# EAGLE design ProjectorAdapter (EAGLE 7.3.0)
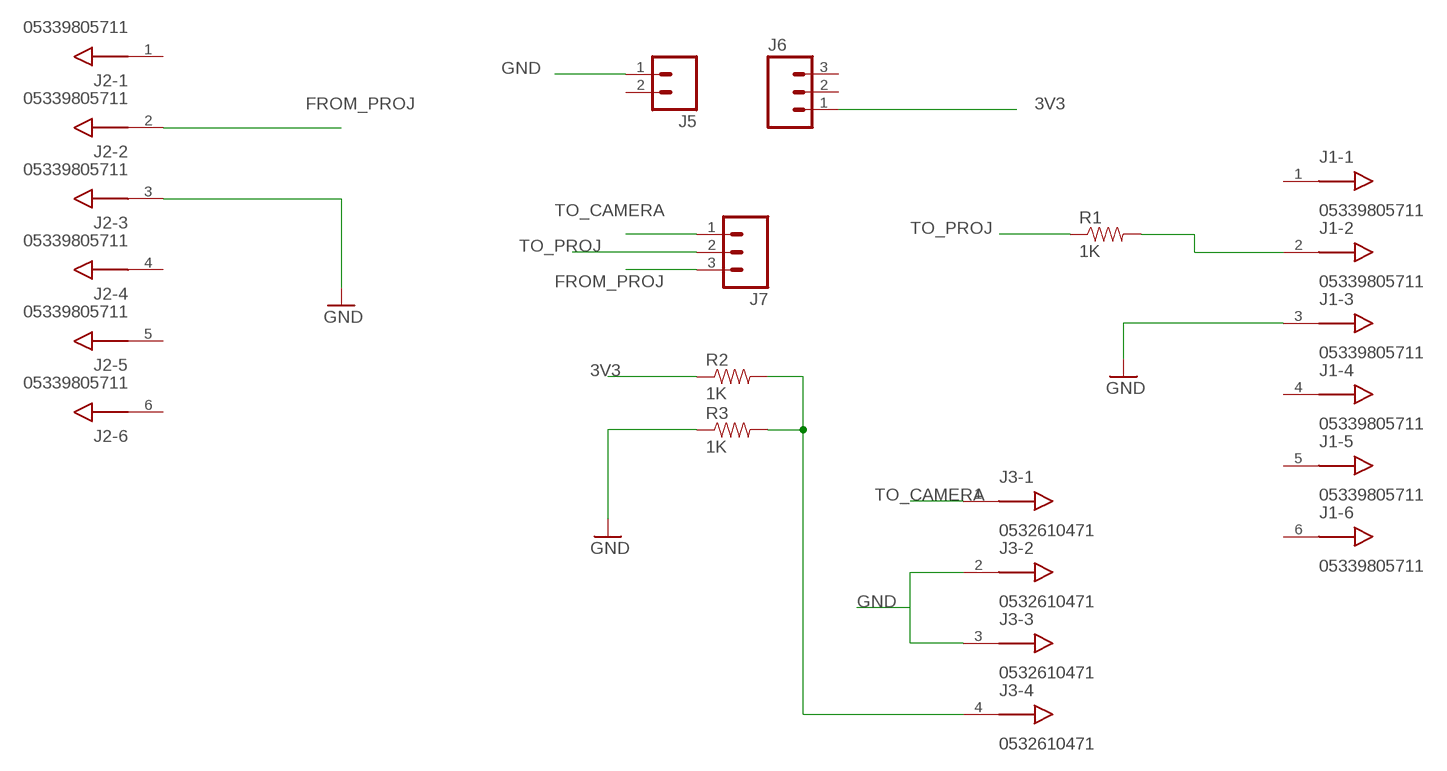
[diagram p0: schematic, sheet 1]

## Parts
J1  05339805711  [PICOBLADE53398-0671]
J2  05339805711  [PICOBLADE53398-0671]
J3  0532610471  [PICOBLADE53261-0471]
J5  M02PTH  [1X02]
J6  M03PTH  [1X03]
J7  M03PTH  [1X03]
R1  1K  RESISTOR0603-RES  [0603-RES]
R2  1K  RESISTOR0603-RES  [0603-RES]
R3  1K  RESISTOR0603-RES  [0603-RES]

## Nets
3V3: J6.1 R2.1
FROM_PROJ: J2.2 J7.3
GND: J1.3 J2.3 J3.2 J3.3 J5.1 R3.1
N$2: J3.4 R2.2 R3.2
N$4: J1.2 R1.2
TO_CAMERA: J3.1 J7.1
TO_PROJ: J7.2 R1.1
Unconnected: J1.1 J1.4 J1.5 J1.6 J2.1 J2.4 J2.5 J2.6 J5.2 J6.2 J6.3

## Library data of the parts
J1 J2 = volks73-Molex:05339805711: 1.25mm Pitch PicoBlade™ Header, Surface Mount, Vertical, 6 Circuits PicoBlade™ Connector System Documentation Drawing <http://www.molex.com/pdm_docs/sd/533980571_sd.pdf>; CATEGORY: Connectors, Interconnects; COLOR: Natural; CONNECTOR_TYPE: Header, Shrouded; CONTACT_FINISH: Tin; CONTACT_FINISH_THICKNESS: 39µin (1.00µm); CONTACT_MATING_LENGTH: -; CONTACT_TYPE: Blade Pin; DESCRIPTION: CONN HEADER 6POS 1.25MM VERT SMD; DOCUMENTATION_LINK: <a href="http://www.molex.com/pdm_docs/sd/533980571_sd.pdf">Drawing</a>; DOCUMENTATION_URL: http://www.molex.com/pdm_docs/sd/533980571_sd.pdf; FAMILY: Rectangular Connectors - Headers, Male Pins; FASTENING_TYPE: -; FEATURES: Solder Retention; MANUFACTURER: Molex Inc; MOUNTING_TYPE: Surface Mount; NUMBER_OF_POSITIONS: 5; NUMBER_OF_POSITIONS_LOADED: All; NUMBER_OF_ROWS: 1; PART_NUMBER: 05339805711; PITCH: 0.049" (1.25mm); ROW_SPACING: -; SERIES: PicoBlade™ 53398; SUPPLIER_ITEM_LINK: <a href="http://www.digikey.com/product-detail/en/0533980571/WM7609CT-ND/699083">Details</a>; SUPPLIER_ITEM_NUMBER: WM7609CT-ND; SUPPLIER_ITEM_URL: http://www.digikey.com/product-detail/en/0533980571/WM7609CT-ND/699083; SUPPLIER_LINK: <a href="http://www.digikey.com">Home Page</a>; SUPPLIER_NAME: Digi-key; SUPPLIER_URL: http://www.digikey.com; TERMINATION: Solder
J3 = volks73-Molex:0532610471: 1.25mm Pitch PicoBlade™ Header, Surface Mount, Right Angle, 4 Circuits PicoBlade™ Connector System Documentation Drawing <http://www.molex.com/pdm_docs/sd/532610471_sd.pdf>; CATEGORY: Connectors, Interconnects; COLOR: Natural; CONNECTOR_TYPE: Header, Shrouded; CONTACT_FINISH: Tin; CONTACT_FINISH_THICKNESS: 39µin (1.00µm); CONTACT_MATING_LENGTH: -; CONTACT_TYPE: Blade Pin; DESCRIPTION: CONN HEADER 4POS 1.25MM R/A SMD; DOCUMENTATION_LINK: <a href="http://www.molex.com/pdm_docs/sd/532610471_sd.pdf">Datasheet</a>; DOCUMENTATION_URL: http://www.molex.com/pdm_docs/sd/532610471_sd.pdf; FAMILY: Rectangular Connectors - Headers, Male Pins; FASTENING_TYPE: -; FEATURES: Solder Retention; MANUFACTURER: Molex Inc; MOUNTING_TYPE: Surface Mount, Right Angle; NUMBER_OF_POSITIONS: 4; NUMBER_OF_POSITIONS_LOADED: All; NUMBER_OF_ROWS: 1; PART_NUMBER: 0533980371; PITCH: 0.049" (1.25mm); ROW_SPACING: -; SERIES: PicoBlade™ 53261; SUPPLIER_ITEM_LINK: <a href="http://www.digikey.com/product-detail/en/0532610471/WM7622CT-ND/699109">Details</a>; SUPPLIER_ITEM_NUMBER: WM7622CT-ND; SUPPLIER_ITEM_URL: http://www.digikey.com/product-detail/en/0532610471/WM7622CT-ND/699109; SUPPLIER_LINK: <a href="http://www.digikey.com">Home Page</a>; SUPPLIER_NAME: Digi-Key; SUPPLIER_URL: http://www.digikey.com; TERMINATION: Solder
J5 = SparkFun-Connectors:M02: Standard 2-pin 0.1" header. Use with - straight break away headers ( PRT-00116) - right angle break away headers (PRT-00553) - swiss pins (PRT-00743) - machine pins (PRT-00117) - female headers (PRT-00115) Molex polarized connector foot print use with: PRT-08233 with associated crimp pins and housings. 2.54_SCREWTERM for use with PRT-10571. 3.5mm Screw Terminal footprints for PRT-08084 5mm Screw Terminal footprints for use with PRT-08432
J6 J7 = SparkFun-Connectors:M03: Header 3 Standard 3-pin 0.1" header. Use with straight break away headers (SKU : PRT-00116), right angle break away headers (PRT-00553), swiss pins (PRT-00743), machine pins (PRT-00117), and female headers (PRT-00115). Molex polarized connector foot print use with SKU : PRT-08232 with associated crimp pins and housings.
R1-R3 = SparkFun-Passives:RESISTOR: Resistor Basic schematic elements and footprints for 0603, 1206, and PTH resistors.

## Board
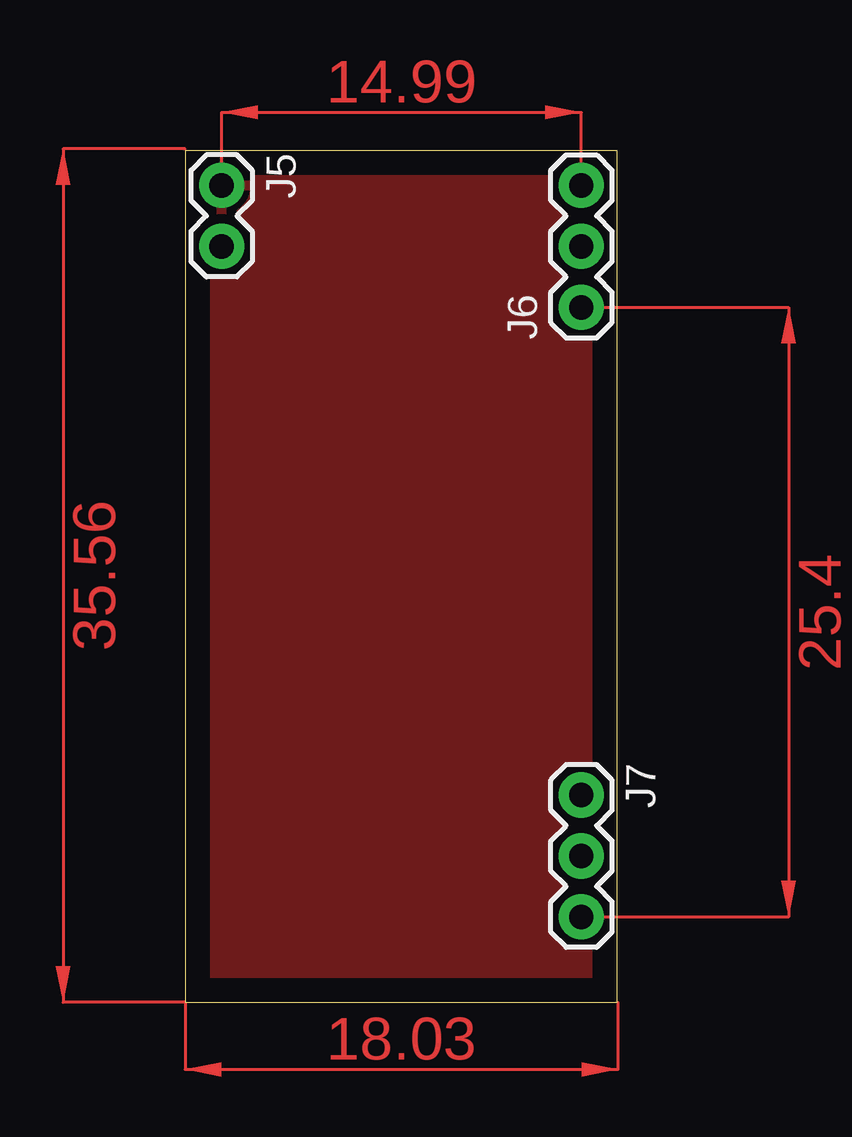
[diagram p1: board, top side]
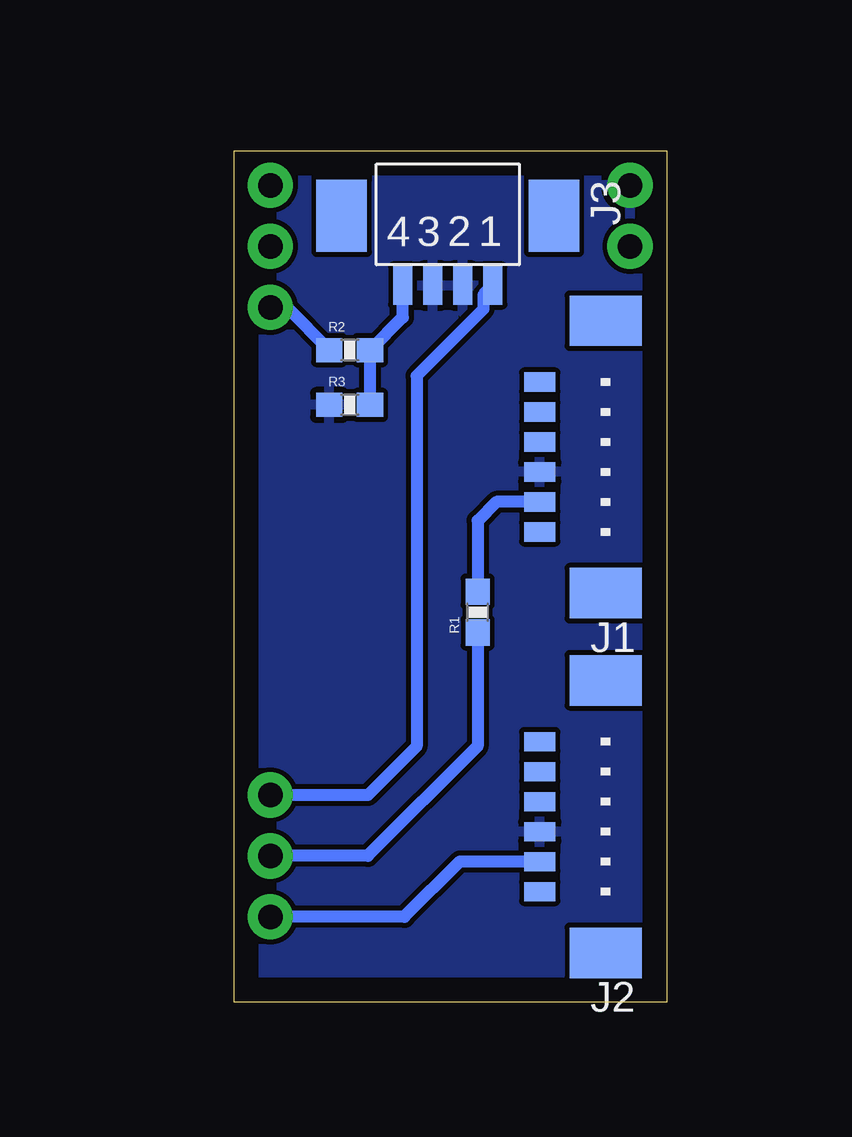
[diagram p2: board, bottom side, seen from below]

Size 18.01 x 35.48 mm. Coordinates in mm from the lower left corner, seen from the top.
Outline: 0,0 18.01,0 18.01,35.48 0,35.48 0,0
Copper layers (1*16): Top 0.035mm / dielectric 1.5mm / Bottom 0.035mm
Design rules "default": minimum track width 10mil, minimum drill 24mil, track to track 8mil, track to pad 8mil, pad to pad 8mil, via to via 8mil, smd to smd 8mil, copper to edge 40mil, drill to drill 8mil, minimum pad ring 10mil, minimum via ring 8mil, stop-mask expansion 4mil, vias tented up to drill 0mil, thermal gap 10mil

### Footprints (pad centres in the part's own frame; a part is rotated, then mirrored left to right if it is on the bottom)
PICOBLADE53398-0671 = smd 0.8 x 1.3: 1 -2.5,2.75; 2 -1.25,2.75; 3 0,2.75; 4 1.25,2.75; 5 2.5,2.75; 6 3.75,2.75 | smd 2.1 x 3: MOUNT1 -5.05,0; MOUNT2 6.3,0
PICOBLADE53261-0471 = smd 0.8 x 1.6: 1 -1.9,2.9; 2 -0.65,2.9; 3 0.6,2.9; 4 1.85,2.9 | smd 2.1 x 3: GND@1 -4.45,0; GND@2 4.4,0
1X02 = drill 1.016 pad 1.88: 1 0,0; 2 2.54,0
1X03 = drill 1.016 pad 1.88: 1 0,0; 2 2.54,0; 3 5.08,0
0603-RES = smd 1.1 x 1: 1 -0.85,0; 2 0.85,0

### Placement (x,y rotation side)
J1  2.54,22.1 90 bottom
J2  2.54,7.11 90 bottom
J3  9.14,32.77 180 bottom
J5  1.52,34.04 270 top
J6  16.51,28.96 90 top
J7  16.51,8.64 270 top
R1  7.87,16.26 90 bottom
R2  13.21,27.18 0 bottom
R3  13.21,24.89 0 bottom

### Tracks (layer width: path | path; a pad name or v marks a point on that pad's centre or on a via)
3V3
  Bottom 0.508: J6.1 15.84,28.96 R2.1
FROM_PROJ
  Bottom 0.508: J2.2 8.62,5.86 10.92,3.56 J7.3
GND
  pour Top (isolate 0.406): 0,35.56 18.03,35.56 18.03,0 0,0
  pour Bottom (isolate 0.152): -0.51,35.56 0,0 18.03,0 18.03,35.56
N$2
  Bottom 0.508: R3.2 R2.2 10.99,28.54 J3.4
N$4
  Bottom 0.508: J1.2 7.09,20.85 7.87,20.07 R1.2
TO_CAMERA
  Top 0.406: J7.1 16.26,8.89
  Bottom 0.508: J3.1 7.64,29.47 7.64,28.88 10.41,26.1 10.41,10.67 12.45,8.64 J7.1
TO_PROJ
  Bottom 0.508: R1.1 7.87,10.67 12.45,6.1 J7.2
(copper drawn outside any net)
  shapes: Top area x4